# Altium schematic sheet RFR24 AMS Design - Microcontroller V1.SchDoc
size A; SheetNumber: 4; SheetTotal: 10
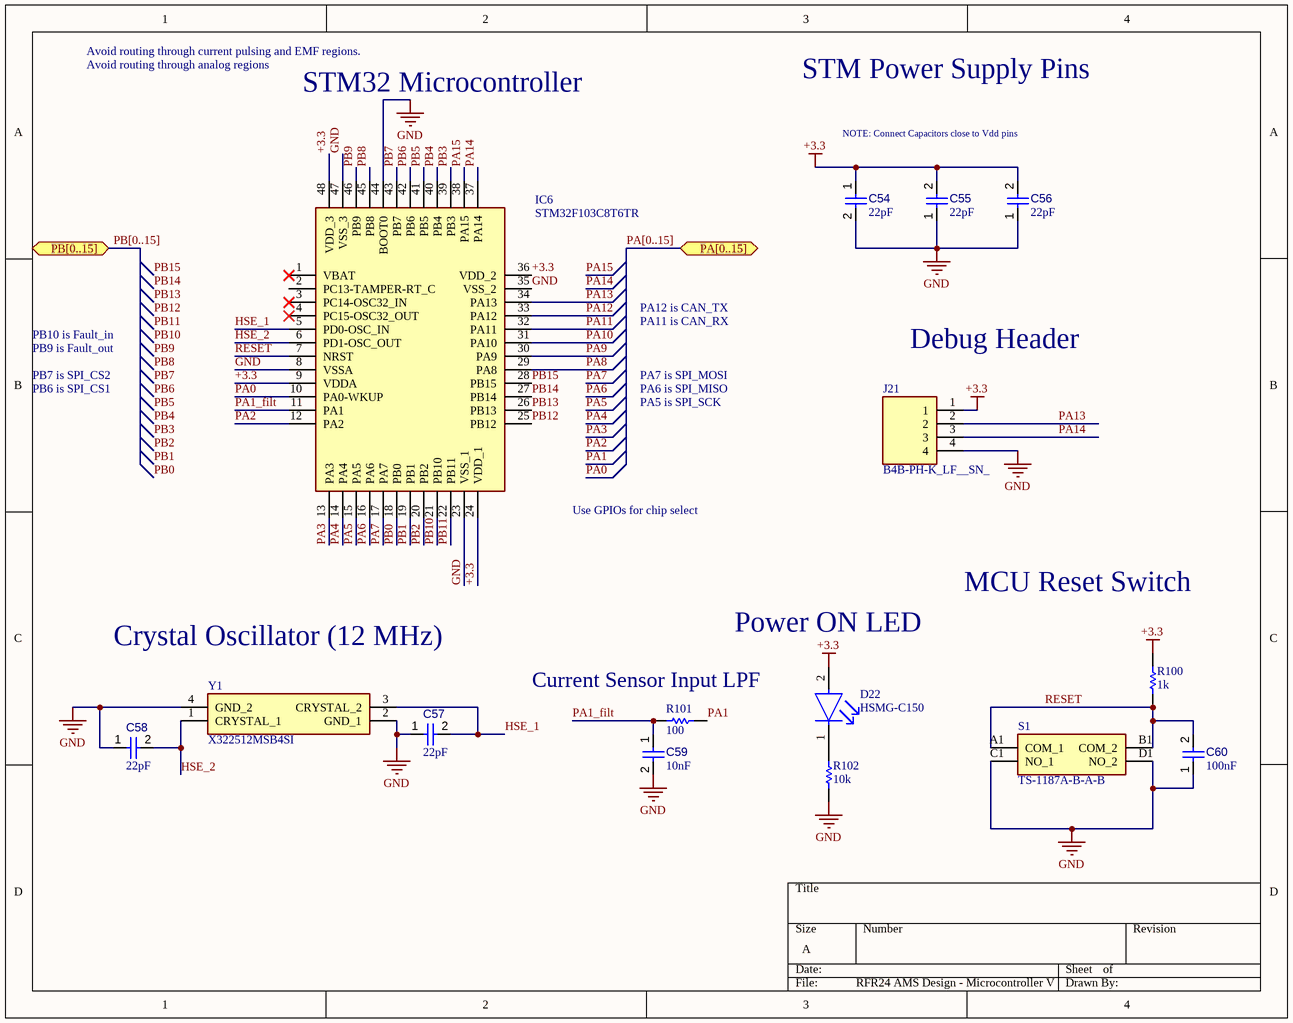
[diagram p0: RFR24 AMS Design - Microcontroller V1.SchDoc]

## Parts
C54  value 22pF  [CAPC2013X145X50LL20T25]  (hidden comment: Capacitor 1 uF +/- 10% 25 V 0805)
C55  value 22pF  [CAPC2013X145X50LL20T25]  (hidden comment: Capacitor 1 uF +/- 10% 25 V 0805)
C56  value 22pF  [CAPC2013X145X50LL20T25]  (hidden comment: Capacitor 1 uF +/- 10% 25 V 0805)
C57  value 22pF  [CAPC2013X145X50LL20T25]  (hidden comment: Capacitor 1 uF +/- 10% 25 V 0805)
C58  value 22pF  [CAPC2013X145X50LL20T25]  (hidden comment: Capacitor 1 uF +/- 10% 25 V 0805)
C59  value 10nF  [CAPC2013X145X50LL20T25]  (hidden comment: Capacitor 1 uF +/- 10% 25 V 0805)
C60  value 100nF  [CAPC2013X145X50LL20T25]  (hidden comment: Capacitor 1 uF +/- 10% 25 V 0805)
D22  HSMG-C150  [FP-HSMG-C150-MFG]
IC6  STM32F103C8T6TR  [QFP50P900X900X160-48N]
J21  B4B-PH-K_LF__SN_  [SHDR4W50P0X200_1X4_990X450X600P]
R100  value 1k  [RESC2013X70X40LL20T20]  (hidden comment: Resistor 1k +/-1% 0805 125 mW)
R101  value 100  [RESC2013X70X40LL20T20]  (hidden comment: Resistor 1k +/-1% 0805 125 mW)
R102  value 10k  [RESC2013X70X40LL20T20]  (hidden comment: Resistor 1k +/-1% 0805 125 mW)
S1  TS-1187A-B-A-B  [TS1187ABAB]
Y1  X322512MSB4SI  [X322512MSB4SI]

## Ports
PA[0..15] (bidir), PB[0..15] (bidir)

## Nets
+3.3: C54.1 C55.2 C56.2 D22.2(A) IC6.9(VDDA) IC6.24(VDD_1) IC6.36(VDD_2) IC6.48(VDD_3) J21.1 R100.2
GND: C54.2 C55.1 C56.1 C57.1 C58.1 C59.2 C60.1 IC6.8(VSSA) IC6.23(VSS_1) IC6.35(VSS_2) IC6.44(BOOT0) IC6.47(VSS_3) J21.4 R102.1 S1.C1(NO_1) S1.D1(NO_2) Y1.2(GND_1) Y1.4(GND_2)
HSE_1: C57.2 IC6.5(PD0-OSC_IN) Y1.3(CRYSTAL_2)
HSE_2: C58.2 IC6.6(PD1-OSC_OUT) Y1.1(CRYSTAL_1)
PA0: IC6.10(PA0-WKUP)
PA1: R101.1
PA1_filt: C59.1 IC6.11(PA1) R101.2
PA2: IC6.12(PA2)
PA3: IC6.13(PA3)
PA4: IC6.14(PA4)
PA5: IC6.15(PA5)
PA6: IC6.16(PA6)
PA7: IC6.17(PA7)
PA8: IC6.29(PA8)
PA9: IC6.30(PA9)
PA10: IC6.31(PA10)
PA11: IC6.32(PA11)
PA12: IC6.33(PA12)
PA13: IC6.34(PA13) J21.2
PA14: IC6.37(PA14) J21.3
PA15: IC6.38(PA15)
PB0: IC6.18(PB0)
PB1: IC6.19(PB1)
PB2: IC6.20(PB2)
PB3: IC6.39(PB3)
PB4: IC6.40(PB4)
PB5: IC6.41(PB5)
PB6: IC6.42(PB6)
PB7: IC6.43(PB7)
PB8: IC6.45(PB8)
PB9: IC6.46(PB9)
PB10: IC6.21(PB10)
PB11: IC6.22(PB11)
PB12: IC6.25(PB12)
PB13: IC6.26(PB13)
PB14: IC6.27(PB14)
PB15: IC6.28(PB15)
RESET: C60.2 IC6.7(NRST) R100.1 S1.A1(COM_1) S1.B1(COM_2)
NetD22_1: D22.1(C) R102.2

Not connected (* = marked no-connect by the designer): IC6 1(VBAT)* 2(PC13-TAMPER-RT_C) 3(PC14-OSC32_IN)* 4(PC15-OSC32_OUT)*

## Buses and harness runs
bus PA[0..15] = port PA[0..15]
bus PB[0..15] = port PB[0..15]

## Notes on the sheet
- Avoid routing through current pulsing and EMF regions.
- Avoid routing through analog regions
- STM32 Microcontroller
- STM Power Supply Pins
- NOTE: Connect Capacitors close to Vdd pins
- PB9 is Fault_out
- PB10 is Fault_in
- PA12 is CAN_TX
- PA11 is CAN_RX
- Debug Header
- PB6 is SPI_CS1
- PB7 is SPI_CS2
- PA5 is SPI_SCK
- PA6 is SPI_MISO
- PA7 is SPI_MOSI
- Use GPIOs for chip select
- Power ON LED
- MCU Reset Switch
- Crystal Oscillator (12 MHz)
- Current Sensor Input LPF
- Labels drawn without touching a wire or pin: PB0, PB1, PB2, PB3, PB4, PB5, PB6, PB7, PB8, PB9, PB10, PB11, PB12, PB13, PB14, PB15

## Library data of the parts
C54-C60 = CMP-001-00010-6: Chip Capacitor, 1 uF, +/-10%, 25 V, 0805 (2012 Metric); Capacitor Type: Ceramic; Voltage Rating: 25V; RoHS Compliant: True; Pins: 2; Mounting Technology: SM; Max Operating Temperature: 125°C; Min Operating Temperature: -55°C; Tolerance: 10%; Case/Package: 0805
D22 = CMP-2000-05061-2: LED GREEN DIFFUSED 1206 SMD; Manufacturer: Broadcom; Led Orientation: Top View; Max Junction Temp: +95°C; Peak Emmision Wavelength: 570nm; Viewing Angle: 170°; Wavelength: 572nm; Reverse Voltage: 5V; Luminous Intensity: 15mcd; Forward Voltage: 2.2V; Power Dissipation: 65mW; Forward Current: 20mA; ComponentLink2Description: Datasheet; Lead Free: Yes; Temperature Range Low: -40°C; Package: HSMG-C150; Digikey Description: LED GREEN DIFFUSED 1206 SMD; Mouser Description: LED Uni-Color Green 570nm 2-Pin Chip LED T/R; Manufacturer Part Number: HSMG-C150; Temperature Range High: +85°C; Device Class L1: Optoelectronics; Colour: Green; Category: Diode; Device Class L3: unset; RoHS: TRUE; Height: 1.2mm; ComponentLink2URL: https://docs.broadcom.com/docs/AV02-0551EN; Device Class L2: LEDs; Automotive: No; Ipc Land Pattern Name: DIOCP320160X55; Octopart: https://octopart.com/hsmg-c150-broadcom-71131304; Temperature: -40°C to +85°C
IC6 = STM32F103C8T6TR: Integrated Circuit; Manufacturer_Name: STMicroelectronics; Datasheet Link: http://media.digikey.com/pdf/Data%20Sheets/ST%20Microelectronics%20PDFS/STM32F103x8,B.pdf; Height: 1.6mm; Manufacturer_Part_Number: STM32F103C8T6TR; Mouser Part Number: 511-STM32F103C8T6TR; Mouser Price/Stock: https://www.mouser.co.uk/ProductDetail/STMicroelectronics/STM32F103C8T6TR?qs=5HwTSiuA5HDxFj62n06yag%3D%3D; Arrow Part Number: STM32F103C8T6TR; Arrow Price/Stock: https://www.arrow.com/en/products/stm32f103c8t6tr/stmicroelectronics?region=europe
J21 = B4B-PH-K_LF__SN_: Connector; Manufacturer_Name: JST (JAPAN SOLDERLESS TERMINALS); Manufacturer_Part_Number: B4B-PH-K(LF)(SN); Datasheet Link: http://www.jst-mfg.com/product/pdf/eng/ePH.pdf; Height: 6mm
R100-R102 = CMP-009-00010-5: Chip Resistor, 1 KOhm, +/- 1%, 0.125 W, -55 to 155 degC, 0805 (2013 Metric); Power: 125mW; Voltage Rating: 150V; Tolerance: 1%; RoHS Compliant: True; Mounting Technology: SM; Pins: 2; Case/Package: 0805; Max Operating Temperature: 155°C; Min Operating Temperature: -55°C
S1 = TS-1187A-B-A-B: Switch; Manufacturer_Name: XKB Connectivity; Datasheet Link: http://www.helloxkb.com/public/images/pdf/TS-1187A-X-X-X.pdf; Height: 4.05mm; Manufacturer_Part_Number: TS-1187A-B-A-B
Y1 = X322512MSB4SI: Crystal or Oscillator; Manufacturer_Name: Yangxing Tech; Datasheet Link: https://datasheet.lcsc.com/szlcsc/Yangxing-Tech-X322512MSB4SI_C9002.pdf; Height: 0.8mm; Manufacturer_Part_Number: X322512MSB4SI